# EAGLE design cgs60 (EAGLE 9.5.2)

## Sheet 1 of 2: CGS60- Synth-In attenuates eurorack signal and outputs at Effect-Send. Effects-Return amplifies a stompbox effect and outputs at Synth-Out.
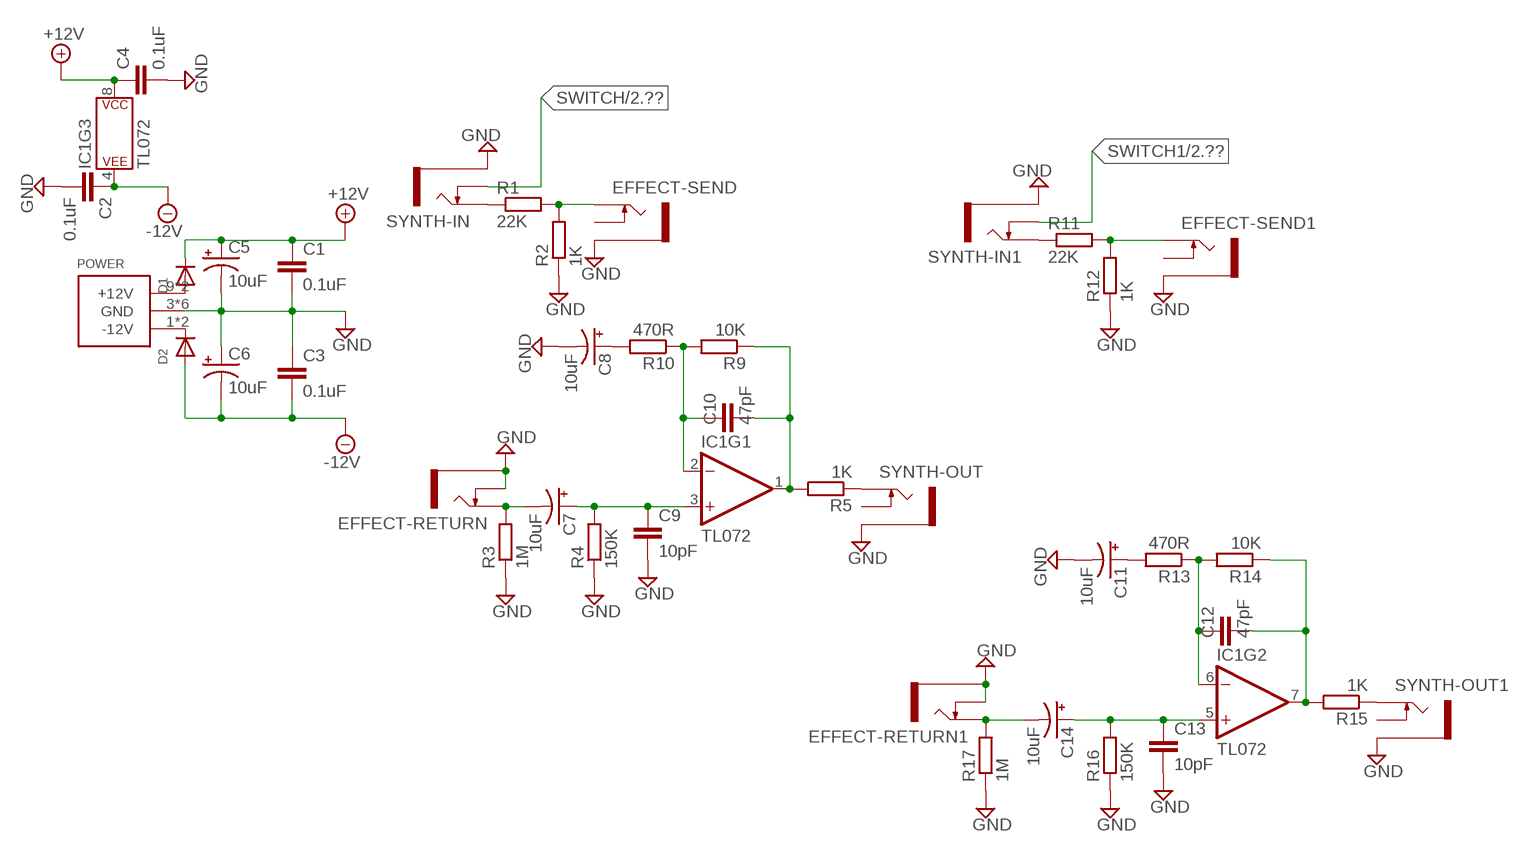
[diagram p0: schematic, sheet 1]

### Parts
C1  0.1uF  0.1UF-0603-25V-(+80/-20%)  [0603]
C2  0.1uF  0.1UF-0603-25V-(+80/-20%)  [0603]
C3  0.1uF  0.1UF-0603-25V-(+80/-20%)  [0603]
C4  0.1uF  0.1UF-0603-25V-(+80/-20%)  [0603]
C5  10uF  CAP_SMD+THRUPAN_B  [PAN_B_SMD+THRU]
C6  10uF  CAP_SMD+THRUPAN_B  [PAN_B_SMD+THRU]
C7  10uF  CAP_SMD+THRUPAN_B  [PAN_B_SMD+THRU]
C8  10uF  CAP_SMD+THRUPAN_B  [PAN_B_SMD+THRU]
C9  10pF  C-EUC0603  [C0603]
C10  47pF  C-EUC0603  [C0603]
C11  10uF  CAP_SMD+THRUPAN_B  [PAN_B_SMD+THRU]
C12  47pF  C-EUC0603  [C0603]
C13  10pF  C-EUC0603  [C0603]
C14  10uF  CAP_SMD+THRUPAN_B  [PAN_B_SMD+THRU]
D1  DIODESOD-123  [SOD-123]
D2  DIODESOD-123  [SOD-123]
EFFECT-RETURN  THONKICONNNEW  [WQP-PJ301M-12_JACK]
EFFECT-RETURN1  THONKICONNNEW  [WQP-PJ301M-12_JACK]
EFFECT-SEND  THONKICONNNEW  [WQP-PJ301M-12_JACK]
EFFECT-SEND1  THONKICONNNEW  [WQP-PJ301M-12_JACK]
IC1  TL072  OPAMP-DUALU  [SO08]
POWER  POWER_SIMPLE10  [POWER_10]
R1  22K  R-EU_R0603  [R0603]
R2  1K  R-EU_R0603  [R0603]
R3  1M  R-EU_R0603  [R0603]
R4  150K  R-EU_R0603  [R0603]
R5  1K  R-EU_R0603  [R0603]
R9  10K  R-EU_R0603  [R0603]
R10  470R  R-EU_R0603  [R0603]
R11  22K  R-EU_R0603  [R0603]
R12  1K  R-EU_R0603  [R0603]
R13  470R  R-EU_R0603  [R0603]
R14  10K  R-EU_R0603  [R0603]
R15  1K  R-EU_R0603  [R0603]
R16  150K  R-EU_R0603  [R0603]
R17  1M  R-EU_R0603  [R0603]
SYNTH-IN  THONKICONNNEW  [WQP-PJ301M-12_JACK]
SYNTH-IN1  THONKICONNNEW  [WQP-PJ301M-12_JACK]
SYNTH-OUT  THONKICONNNEW  [WQP-PJ301M-12_JACK]
SYNTH-OUT1  THONKICONNNEW  [WQP-PJ301M-12_JACK]

### Nets
+12V: C1.1 C4.1 C5.+ C5.++(+) D1.C IC1.8(P$V+)
-12V: C2.1 C3.2 C6.- C6.--(-) D2.A IC1.4(P$V-)
GND: C1.2 C2.2 C3.1 C4.2 C5.- C5.--(-) C6.+ C6.++(+) C8.- C8.--(-) C9.2 C11.- C11.--(-) C13.2 EFFECT-RETURN1.P$2_SWITCH(SWITCH) EFFECT-RETURN1.P$3_SLEEVE(SLEEVE) EFFECT-RETURN.P$2_SWITCH(SWITCH) EFFECT-RETURN.P$3_SLEEVE(SLEEVE) EFFECT-SEND1.P$3_SLEEVE(SLEEVE) EFFECT-SEND.P$3_SLEEVE(SLEEVE) POWER.3(GND) POWER.4(GND) POWER.5(GND) POWER.6(GND) POWER.7(GND) POWER.8(GND) R2.1 R3.1 R4.1 R12.1 R16.1 R17.1 SYNTH-IN1.P$3_SLEEVE(SLEEVE) SYNTH-IN.P$3_SLEEVE(SLEEVE) SYNTH-OUT1.P$3_SLEEVE(SLEEVE) SYNTH-OUT.P$3_SLEEVE(SLEEVE) ; also sheet 2
N$3: R1.1 SYNTH-IN.P$1_TIP(TIP)
N$4: EFFECT-SEND.P$1_TIP(TIP) R1.2 R2.2
N$5: C10.2 IC1.1(OUT) R5.2 R9.1
N$6: D1.A POWER.9(+12V) POWER.10(+12V)
N$8: C10.1 IC1.2(-IN) R9.2 R10.1
N$9: C8.+ C8.++(+) R10.2
N$10: C7.+ C7.++(+) C9.1 IC1.3(+IN) R4.2
N$11: C7.- C7.--(-) EFFECT-RETURN.P$1_TIP(TIP) R3.2
N$12: R5.1 SYNTH-OUT.P$1_TIP(TIP)
N$13: R11.1 SYNTH-IN1.P$1_TIP(TIP)
N$14: EFFECT-SEND1.P$1_TIP(TIP) R11.2 R12.2
N$15: C11.+ C11.++(+) R13.2
N$17: C12.2 IC1.7(OUT) R14.1 R15.2
N$18: R15.1 SYNTH-OUT1.P$1_TIP(TIP)
N$19: C14.- C14.--(-) EFFECT-RETURN1.P$1_TIP(TIP) R17.2
N$20: C12.1 IC1.6(-IN) R13.1 R14.2
N$21: C13.1 C14.+ C14.++(+) IC1.5(+IN) R16.2
N$22: D2.C POWER.1(-12V) POWER.2(-12V)
SWITCH: SYNTH-IN.P$2_SWITCH(SWITCH) ; also sheet 2
SWITCH1: SYNTH-IN1.P$2_SWITCH(SWITCH) ; also sheet 2
Unconnected: EFFECT-SEND1.P$2_SWITCH(SWITCH) EFFECT-SEND.P$2_SWITCH(SWITCH) SYNTH-OUT1.P$2_SWITCH(SWITCH) SYNTH-OUT.P$2_SWITCH(SWITCH)

## Sheet 2 of 2
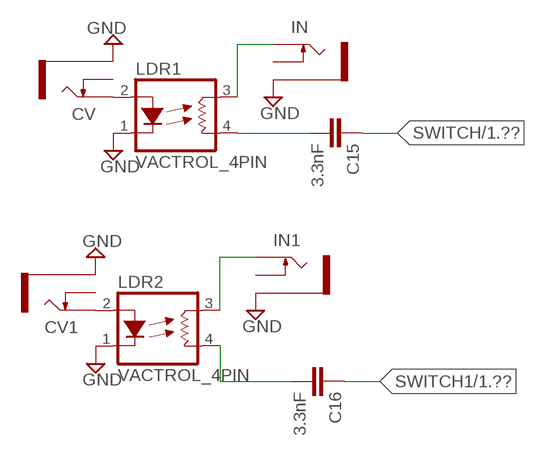
[diagram p1: schematic, sheet 2]

### Parts
C15  3.3nF  3.3NF-0603-100V-10%  [0603]
C16  3.3nF  3.3NF-0603-100V-10%  [0603]
CV  THONKICONNNEW  [WQP-PJ301M-12_JACK]
CV1  THONKICONNNEW  [WQP-PJ301M-12_JACK]
IN  THONKICONNNEW  [WQP-PJ301M-12_JACK]
IN1  THONKICONNNEW  [WQP-PJ301M-12_JACK]
LDR1  VACTROL_4PIN  [VACTROL_4PIN_VTL5C]
LDR2  VACTROL_4PIN  [VACTROL_4PIN_VTL5C]

### Nets
GND: CV1.P$3_SLEEVE(SLEEVE) CV.P$3_SLEEVE(SLEEVE) IN1.P$3_SLEEVE(SLEEVE) IN.P$3_SLEEVE(SLEEVE) LDR1.1(LED-) LDR2.1(LED-) ; also sheet 1
N$7: CV.P$1_TIP(TIP) LDR1.2(LED+)
N$16: IN.P$1_TIP(TIP) LDR1.3(RES1)
N$23: C15.2 LDR1.4(RES2)
N$25: CV1.P$1_TIP(TIP) LDR2.2(LED+)
N$26: IN1.P$1_TIP(TIP) LDR2.3(RES1)
N$28: C16.2 LDR2.4(RES2)
SWITCH: C15.1 ; also sheet 1
SWITCH1: C16.1 ; also sheet 1
Unconnected: CV1.P$2_SWITCH(SWITCH) CV.P$2_SWITCH(SWITCH) IN1.P$2_SWITCH(SWITCH) IN.P$2_SWITCH(SWITCH)

## Library data of the parts
C1-C4 = SparkFun-Capacitors:0.1UF: 0.1µF ceramic capacitors A capacitor is a passive two-terminal electrical component used to store electrical energy temporarily in an electric field.; PROD_ID: CAP-00810
C5-C8 C11 C14 = MusicThingModular:CAP_SMD+THRU
C9 C10 C12 C13 = resistor:C-EU: CAPACITOR, European symbol
C15 C16 = SparkFun-Capacitors:3.3NF: 3.3nF ceramic capacitors A capacitor is a passive two-terminal electrical component used to store electrical energy temporarily in an electric field.; PROD_ID: CAP-09633
CV CV1 EFFECT-RETURN EFFECT-RETURN1 EFFECT-SEND EFFECT-SEND1 IN IN1 SYNTH-IN SYNTH-IN1 SYNTH-OUT SYNTH-OUT1 = MusicThingModular:THONKICONN: 3.5mm socket for Eurorack modular synths
D1 D2 = adafruit:DIODE: Diode SMADIODE - SMA Surface Mount Package 20V 1A Schottky Diode Digikey: 641-1014-6-ND DO-1N4148 - Through Hole Small Current Diode SOD-123 20V 1 A (.5mV Vf) Schottky Diode - Digikey: MBRX120TPMSCT-ND SOD-323 10V 570mA (.38mV Vf, 3ns) Schottky Diode - Digikey: ZLLS410CT-ND SOD-523 30V 30mA Schottky Diode (RB751S-40TE61) - Digikey: RB751S-40TE61CT-ND SOT23-R/W - SOT23 Package (R = Solder Paste/Reflow Ovens, W = Hand-Soldering) BAT54Film 40V 300mA - Digikey: 497-7162-1-ND
IC1 = SparkFun-IC-Amplifiers:OPAMP-DUAL: Generic op-amp footprint This component is for the standard 358 pinning of a dual op-amp From the LM358 datasheet: Pin 1: Output A Pin 2: Inverting Input A Pin 3: Non-Inverting Input A Pin 4: Gnd Pin 5: Non-Inverting Input B Pin 6: Inverting Input B Pin 7: Output B Pin 8: V+; PROD_ID: NA-XXXXX; VALUE: OP-AMP
LDR1 LDR2 = MusicThingModular:VACTROL_4PIN: 4 Pin Vactrol Resistive Photocoupler
POWER = eurorack:POWER_SIMPLE
R1-R5 R9-R17 = resistor:R-EU_: RESISTOR, European symbol

## Board
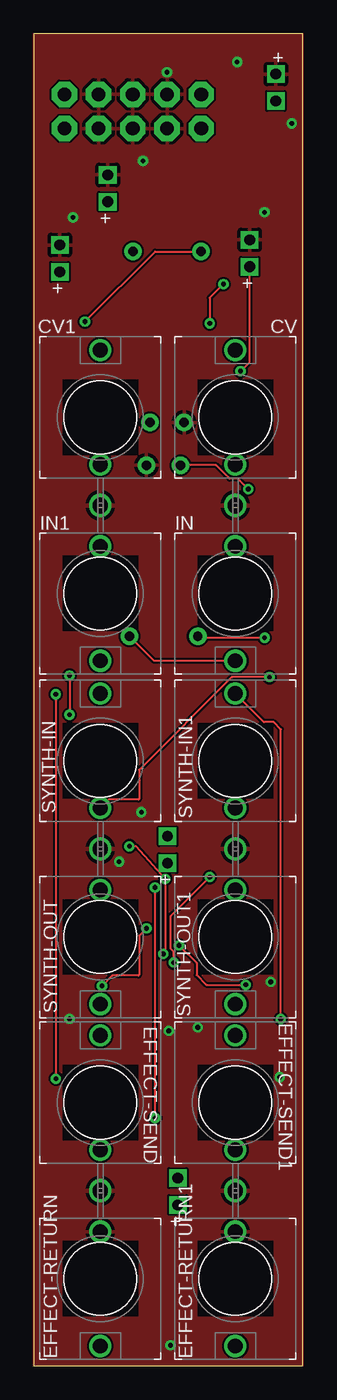
[diagram p2: board, top side]
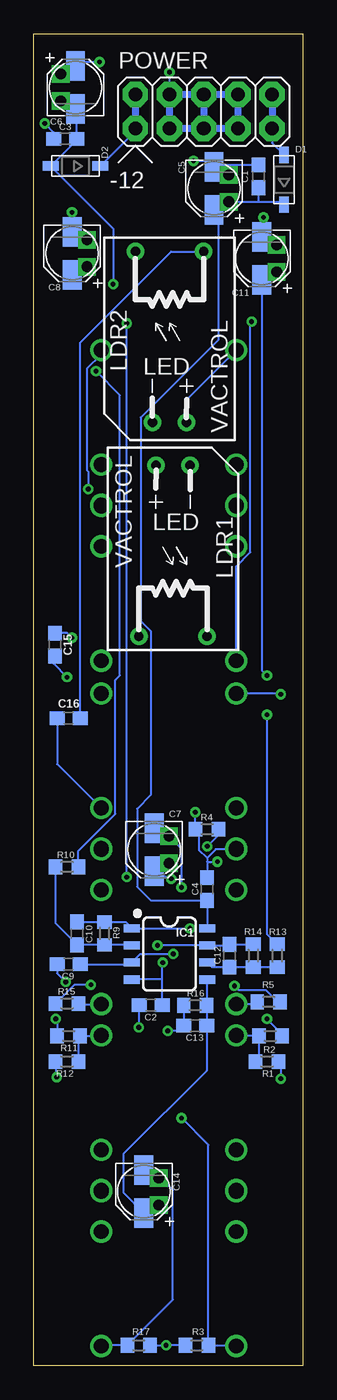
[diagram p3: board, bottom side, seen from below]

Size 20 x 99 mm. Coordinates in mm from the lower left corner, seen from the top.
Outline: 0,0 20,0 20,99 0,99 0,0
Copper layers (1*16): Top 0.035mm / dielectric 1.5mm / Bottom 0.035mm
Design rules "default *": minimum track width 6mil, minimum drill 0.35mm, track to track 6mil, track to pad 6mil, pad to pad 6mil, via to via 6mil, smd to smd 6mil, copper to edge 0mil, drill to drill 6mil, minimum pad ring 10mil, minimum via ring 8mil, stop-mask expansion 4mil, vias tented up to drill 0mil, thermal gap 10mil

### Footprints (pad centres in the part's own frame; a part is rotated, then mirrored left to right if it is on the bottom)
0603 = smd 1.1 x 1: 1 -0.85,0; 2 0.85,0
PAN_B_SMD+THRU = smd 2.2 x 1.4: + 1.6,0; - -1.6,0 | drill 0.8 pad 0.9 square: ++ 1,1.1; -- -1,1.1
C0603 = smd 1.1 x 1: 1 -0.85,0; 2 0.85,0
WQP-PJ301M-12_JACK = drill 1.1: P$1_TIP 0,5; P$2_SWITCH 0,-3.5; P$3_SLEEVE 0,-6.5
SOD-123 = smd 1.2 x 0.7: A 1.85,0; C -1.85,0
SO08 = smd 0.6 x 1.2: 1 -1.905,-2.8; 2 -0.635,-2.8; 3 0.635,-2.8; 4 1.905,-2.8; 5 1.905,2.8; 6 0.635,2.8; 7 -0.635,2.8; 8 -1.905,2.8
VACTROL_4PIN_VTL5C = drill 0.7 pad 1.3: 1 -6.35,1.27; 2 -6.35,-1.27; 3 6.35,2.54; 4 6.35,-2.54
POWER_10 = drill 1.016 pad 1.88 octagon: 1 -5.08,-1.27; 2 -5.08,1.27; 3 -2.54,-1.27; 4 -2.54,1.27; 5 0,-1.27; 6 0,1.27; 7 2.54,-1.27; 8 2.54,1.27; 9 5.08,-1.27; 10 5.08,1.27
R0603 = smd 1 x 1.1: 1 -0.85,0; 2 0.85,0

### Placement (x,y rotation side)
C1  3.3,88.39 90 bottom
C2  11.3,26.8 180 bottom
C3  17.65,91.19 0 bottom
C4  7.11,35.43 90 bottom
C5  6.6,87.5 270 bottom
C6  16.89,95 90 bottom
C7  11.05,38.35 270 bottom
C8  17.14,82.68 270 bottom
C9  17.4,29.84 180 bottom
C10  16.76,32.13 90 bottom
C11  3.05,82.3 270 bottom
C12  5.46,30.48 90 bottom
C13  8,25.27 180 bottom
C14  11.81,12.95 270 bottom
C15  18.41,53.59 90 bottom
C16  17.4,48.13 0 bottom
CV  14.99,70.48 0 top
CV1  4.95,70.48 0 top
D1  1.4,88.14 90 bottom
D2  16.89,89.15 180 bottom
EFFECT-RETURN  4.95,6.48 180 top
EFFECT-RETURN1  14.99,6.48 180 top
EFFECT-SEND  4.95,19.56 0 top
EFFECT-SEND1  14.99,19.56 0 top
IC1  9.91,30.61 270 bottom
IN  14.99,57.4 180 top
IN1  4.95,57.4 180 top
LDR1  9.65,60.58 270 bottom
LDR2  9.91,76.45 90 bottom
POWER  7.37,93.22 0 bottom
R1  2.67,22.61 180 bottom
R2  2.41,24.51 180 bottom
R3  7.87,1.52 0 bottom
R4  7.11,39.88 0 bottom
R5  2.54,27.05 0 bottom
R9  14.73,32.13 270 bottom
R10  17.53,37.08 0 bottom
R11  17.4,24.51 0 bottom
R12  17.53,22.61 0 bottom
R13  1.91,30.48 90 bottom
R14  3.68,30.48 270 bottom
R15  17.53,26.92 180 bottom
R16  8,26.8 0 bottom
R17  12.19,1.52 180 bottom
SYNTH-IN  4.95,44.96 0 top
SYNTH-IN1  14.99,44.96 0 top
SYNTH-OUT  4.95,31.88 180 top
SYNTH-OUT1  14.99,31.88 180 top

### Tracks (layer width: path | path; a pad name or v marks a point on that pad's centre or on a via)
+12V
  Bottom 0.152: D1.C 1.4,86.36 1.54,86.5 3.3,86.5 | 3.3,86.5 C5.++ 6,86.5 C5.+ 6.26,85.56 6.26,76.26 12.05,70.47 12.05,55.33 11.31,54.59 11.31,42.41 12.32,41.4 12.32,35.59 11.3,34.57 9.64,34.57 C4.1 IC1.8 | C1.1 3.3,86.5
-12V  (via drill 0.35)
  Top 0.152: v10.41,29.97 10.41,30.77 10.19,30.99 10.19,33.43 v13.08,36.32 | v14.1,80.39 13.08,79.38 v13.08,77.47
  Bottom 0.152: C2.1 10.45,28.7 | 10.45,28.7 10.45,29.93 v10.41,29.97 | v13.08,36.32 v13.08,77.47 | C6.-- 17.49,94 C6.- 16.8,93.31 C3.2 16.8,91.09 D2.A 14.1,84.51 v14.1,80.39 | 10.45,28.7 IC1.4
GND  (via drill 0.35)
  Bottom 0.152: C11.- 2.92,84.02 v2.92,85.34 | C9.2 18.25,29.17 v17.62,28.54 | R16.1 C13.2 9.23,24.89 v10.03,24.89 | R2.1 1.56,24.68 v2.67,25.78 | R17.1 v10.16,1.52 R3.1 | R12.1 18.38,21.55 v18.29,21.46 | v8,41.15 8,39.92 R4.1 7.72,39.63 7.72,38.36 7.11,37.75 | v17.14,85.72 C8.- 16.64,84.28 C8.-- | C2.2 12.19,26.76 v12.19,25.15 | C6.++ 17.49,96 C6.+ 16.59,96.9 v15.11,96.9 | C3.1 18.5,91.66 v19.18,92.33 | C5.-- 6.1,89.1 C5.- | C1.2 6.46,89.24 C5.- | C5.- 7.04,89.53 v8.13,89.53 | 7.11,37.75 7.11,37.47 | 7.11,37.47 C4.2 | SYNTH-OUT.P$3_SLEEVE 6.49,38.38 7.11,37.75 | 7.11,37.47 v6.35,37.47 | POWER.4 v9.91,96.14
  Bottom 0.508: POWER.5 POWER.7 POWER.8 POWER.6 | POWER.5 POWER.3 POWER.4 POWER.6 | POWER.6 POWER.5
  pour Top: 0,0 0,99 20,99 20,0
N$3  (via drill 0.35)
  Top 0.152: v1.65,49.91 v1.65,21.34
  Bottom 0.152: R1.1 1.65,22.44 v1.65,21.34 | v1.65,49.91 1.7,49.96 SYNTH-IN.P$1_TIP
N$4
  Bottom 0.152: R1.2 3.26,22.86 R2.2 4.91,24.51 EFFECT-SEND.P$1_TIP
N$5  (via drill 0.35)
  Top 0.152: v8.38,32.51 7.83,31.96 7.83,29.05 7.79,29 5.85,29 v5.08,28.23
  Bottom 0.152: C10.2 R9.1 13.18,32.98 IC1.1 v8.38,32.51 | v5.08,28.23 4.78,27.93 2.77,27.93 1.64,26.8 1.35,26.8 1.35,27.05 R5.2
N$6
  Bottom 0.152: POWER.9 2.29,91.82 2.29,90.88 D1.A
  Bottom 0.508: POWER.10 2.29,91.82
N$7  (via drill 0.35)
  Top 0.152: v15.94,65.15 15.16,65.93 14.55,65.93 13.55,66.93 LDR1.2
  Bottom 0.152: CV.P$1_TIP 14.99,75.15 16.04,74.1 16.04,66.55 15.94,66.45 v15.94,65.15
N$8
  Bottom 0.152: IC1.2 12.74,31.28 R9.2 C10.1 18.38,32.89 R10.1
N$9  (via drill 0.35)
  Top 0.152: v15.37,73.91 16.05,74.59 C8.++
  Bottom 0.152: R10.2 16.68,38.28 13.93,41.02 13.93,50.97 13.59,51.31 13.59,72.14 v15.37,73.91 | C8.++ 16.55,81.68 C8.+
N$10  (via drill 0.35)
  Top 0.152: v7.11,38.61 7.62,38.61 v9.78,36.2 9.78,30.76 v9.62,30.61
  Bottom 0.152: C7.++ 10.45,37.35 C7.+ v9.78,36.2 | v7.11,38.61 6.26,39.46 R4.2 | C9.1 12.83,29.84 IC1.3 12.07,30.61 v9.62,30.61
N$11  (via drill 0.35)
  Top 0.152: v9.02,18.41 v9.02,35.56
  Bottom 0.152: EFFECT-RETURN.P$1_TIP 6.98,1.48 R3.2 7.02,16.42 v9.02,18.41 | v9.02,35.56 9.02,38.42 C7.-- 10.55,39.95 C7.-
N$12
  Bottom 0.152: R5.1 3.56,26.88 SYNTH-OUT.P$1_TIP
N$13  (via drill 0.35)
  Top 0.152: SYNTH-IN1.P$1_TIP 17.11,47.83 17.82,47.83 18.36,47.29 v18.36,25.78
  Bottom 0.152: v18.36,25.78 18.25,25.67 R11.1
N$14
  Bottom 0.152: R12.2 16.68,24.38 R11.2 15.03,24.51 EFFECT-SEND1.P$1_TIP
N$15  (via drill 0.35)
  Top 0.152: v2.67,51.31 v2.67,48.39
  Bottom 0.152: C11.++ 2.45,81.3 C11.+ 3.05,51.69 v2.67,51.31 | v2.67,48.39 2.67,32.09 R13.2
N$16
  Top 0.152: LDR1.3 8.94,52.4 IN.P$1_TIP
N$17  (via drill 0.35)
  Top 0.152: v10.79,31.24 12.11,29.93 12.11,29.05 12.83,28.32 v15.75,28.32
  Bottom 0.152: R14.1 C12.2 5.55,31.24 IC1.7 v10.79,31.24 | v15.75,28.32 16.98,28.32 R15.2
N$18
  Bottom 0.152: R15.1 16.63,26.88 SYNTH-OUT1.P$1_TIP
N$19
  Bottom 0.152: EFFECT-RETURN1.P$1_TIP 14.94,1.52 R17.2 9.65,4.91 9.65,13.08 10.53,13.95 C14.-- 11.21,13.95 C14.-
N$20
  Bottom 0.152: IC1.6 6.76,29.63 C12.1 R14.2 R13.1
N$21
  Bottom 0.152: IC1.5 7.15,28.66 R16.2 C13.1 7.15,21.93 13.34,15.75 13.34,12.88 C14.+ 11.31,11.35 C14.++
N$22
  Bottom 0.152: D2.C 12.45,91.75 12.45,91.82 POWER.1
  Bottom 0.508: POWER.2 12.45,91.82
N$23  (via drill 0.35)
  Top 0.152: v17.16,54.1 12.32,54.1 LDR1.4
  Bottom 0.152: v17.16,54.1 17.5,54.44 C15.2
N$25
  Bottom 0.152: CV1.P$1_TIP 8.64,71.8 LDR2.2
N$26  (via drill 0.35)
  Top 0.152: v3.81,77.6 9.02,82.8 LDR2.3
  Bottom 0.152: IN1.P$1_TIP 4.95,59.41 3.9,60.47 3.9,77.51 v3.81,77.6
N$28
  Bottom 0.152: C16.2 16.55,76.03 9.78,82.8 LDR2.4
SWITCH  (via drill 0.35)
  Top 0.152: SYNTH-IN.P$2_SWITCH 5.58,42.08 7.79,42.08 7.83,42.13 7.83,44.29 14.72,51.18 v17.53,51.18
  Bottom 0.152: C15.1 18.52,52.18 v17.53,51.18
SWITCH1
  Bottom 0.152: C16.1 18.25,44.72 SYNTH-IN1.P$2_SWITCH